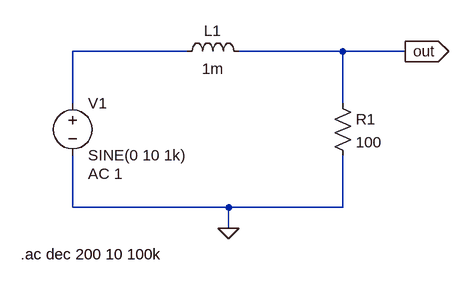
[diagram p0: schematic Part1.asc]
Part1.asc, the LTspice schematic file:
Version 4.1
SHEET 1 1312 680
WIRE 272 32 96 32
WIRE 512 32 352 32
WIRE 608 32 512 32
WIRE 96 112 96 32
WIRE 512 112 512 32
WIRE 96 272 96 192
WIRE 336 272 96 272
WIRE 512 272 512 192
WIRE 512 272 336 272
WIRE 336 304 336 272
FLAG 336 304 0
FLAG 608 32 out
IOPIN 608 32 Out
SYMBOL voltage 96 96 R0
WINDOW 123 24 124 Left 2
WINDOW 39 0 0 Left 0
SYMATTR InstName V1
SYMATTR Value SINE(0 10 1k)
SYMATTR Value2 AC 1
SYMBOL ind 256 48 R270
WINDOW 0 32 56 VTop 2
WINDOW 3 5 56 VBottom 2
SYMATTR InstName L1
SYMATTR Value 1m
SYMBOL res 496 96 R0
SYMATTR InstName R1
SYMATTR Value 100
TEXT 16 344 Left 2 !.ac dec 200 10 100k

The netlist it stands for:
* Part1.asc
V1 N001 0 SINE(0 10 1k) AC 1
L1 N001 out 1m
R1 out 0 100
.ac dec 200 10 100k
.backanno
.end